# EAGLE schematic ccnor_stm32_v24-sync-unified-ss (EAGLE 6.1)
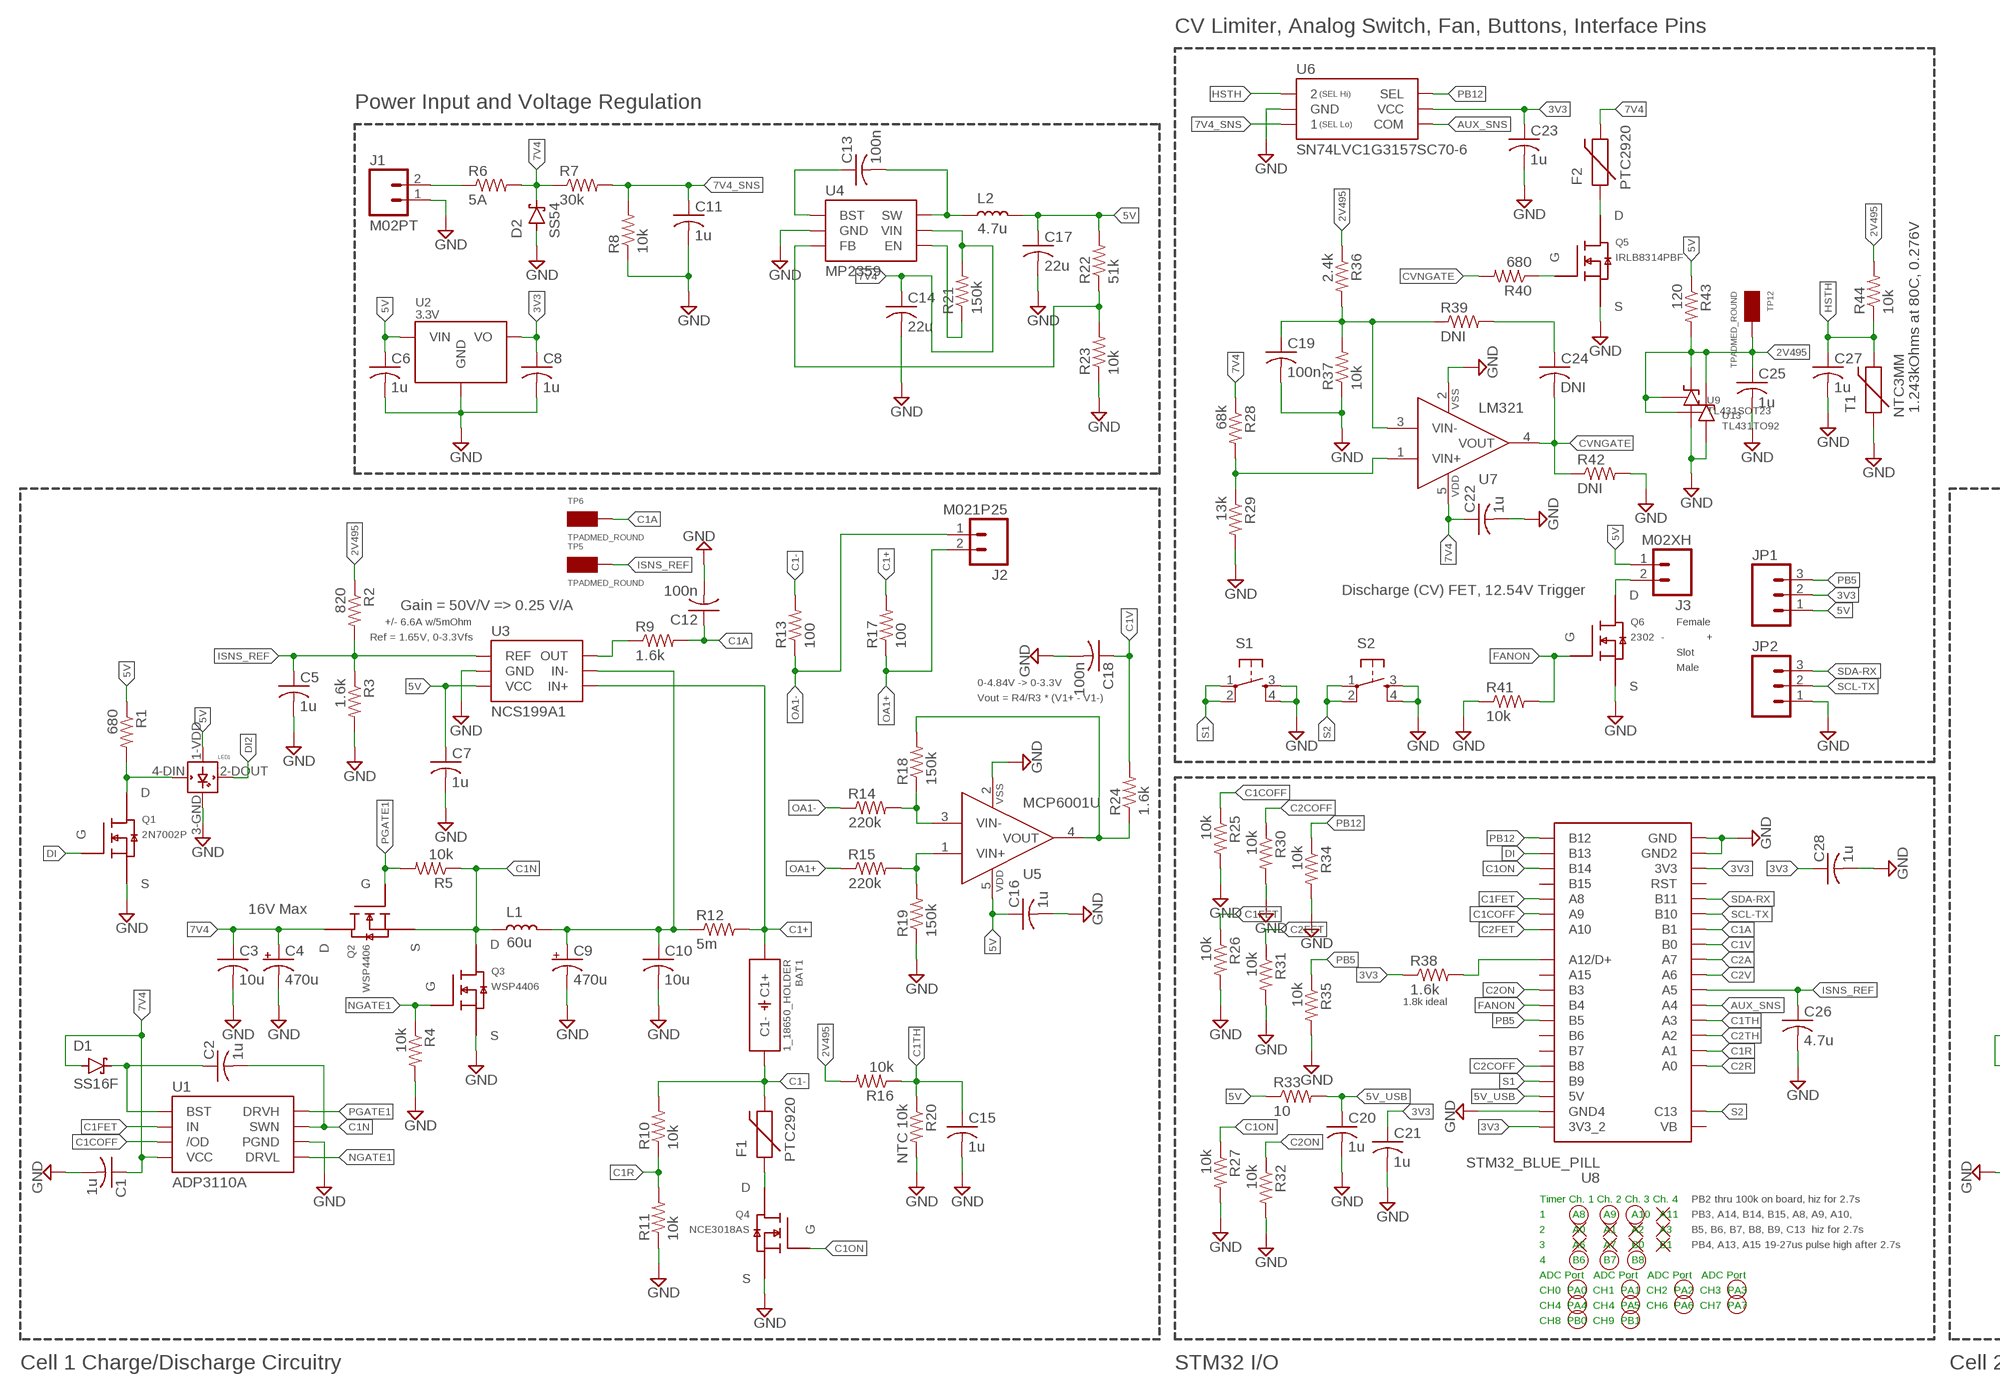
[diagram p0: schematic, sheet 1, part 1 of 2]
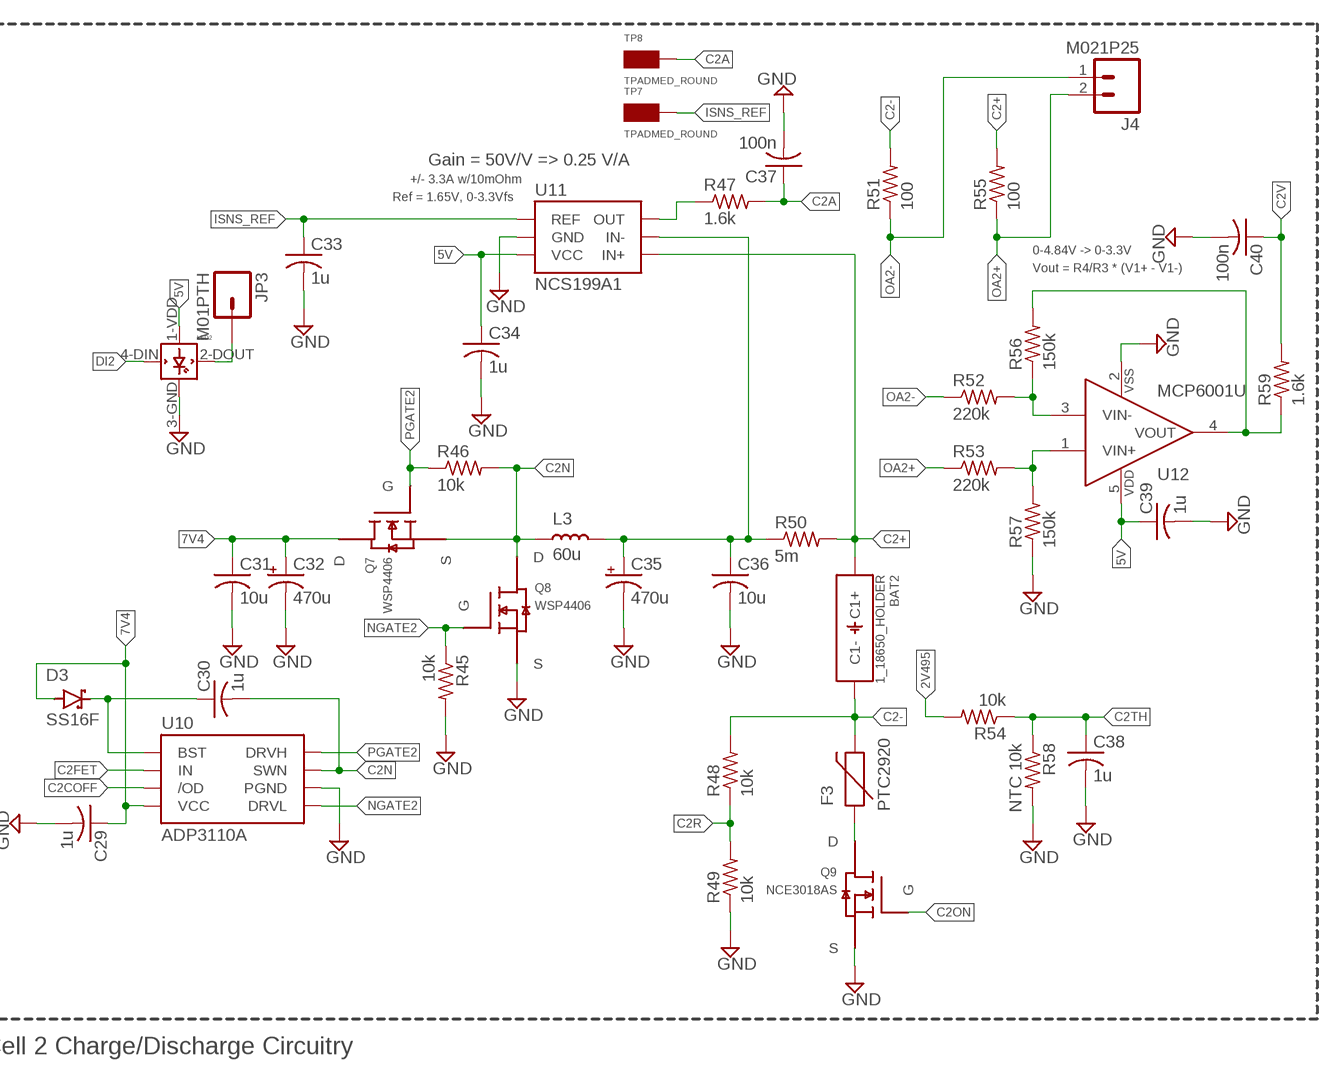
[diagram p1: schematic, sheet 1, part 2 of 2]

## Parts
BAT1  1_18650_HOLDER  [1S_18650_SMD_NH]
BAT2  1_18650_HOLDER  [1S_18650_SMD_NH]
C1  1u  C-USC0402  [C0402]
C2  1u  C-USC0603  [C0603]
C3  10u  C-USC1206  [C1206]
C4  470u  CPOL-USE2.5-7  [E2,5-7]
C5  1u  C-USC0402  [C0402]
C6  1u  C-USC0402  [C0402]
C7  1u  C-USC0402  [C0402]
C8  1u  C-USC0402  [C0402]
C9  470u  CPOL-USE2.5-7  [E2,5-7]
C10  10u  C-USC1206  [C1206]
C11  1u  C-USC0402  [C0402]
C12  100n  C-USC0402  [C0402]
C13  100n  C-USC0402  [C0402]
C14  22u  C-USC0805  [C0805]
C15  1u  C-USC0402  [C0402]
C16  1u  C-USC0402  [C0402]
C17  22u  C-USC0603  [C0603]
C18  100n  C-USC0402  [C0402]
C19  100n  C-USC0402  [C0402]
C20  1u  C-USC0402  [C0402]
C21  1u  C-USC0402  [C0402]
C22  1u  C-USC0402  [C0402]
C23  1u  C-USC0402  [C0402]
C24  DNI  C-USC0402  [C0402]
C25  1u  C-USC0402  [C0402]
C26  4.7u  C-USC0402  [C0402]
C27  1u  C-USC0402  [C0402]
C28  1u  C-USC0402  [C0402]
C29  1u  C-USC0402  [C0402]
C30  1u  C-USC0603  [C0603]
C31  10u  C-USC1206  [C1206]
C32  470u  CPOL-USE2.5-7  [E2,5-7]
C33  1u  C-USC0402  [C0402]
C34  1u  C-USC0402  [C0402]
C35  470u  CPOL-USE2.5-7  [E2,5-7]
C36  10u  C-USC1206  [C1206]
C37  100n  C-USC0402  [C0402]
C38  1u  C-USC0402  [C0402]
C39  1u  C-USC0402  [C0402]
C40  100n  C-USC0402  [C0402]
D1  SS16F  DIODE_SCHOTTKYCDBM140-G  [SOD123]
D2  SS54  [SMA]
D3  SS16F  DIODE_SCHOTTKYCDBM140-G  [SOD123]
F1  PTC2920  [2920]
F2  PTC2920  [2920]
F3  PTC2920  [2920]
J1  M02PT  [PHOENIXCONTACT1935161]
J2  M021P25  [M02_1P25MM]
J3  M02XH  [B2B-XH-A]
J4  M021P25  [M02_1P25MM]
JP1  M03PTH  [1X03]
JP2  M03PTH  [1X03]
JP3  M01PTH  [1X01]
L1  60u  INDUCTOR10A  [INDUCTOR_10A_8.2MMX21MM]
L2  4.7u  INDUCTOR0805  [0805]
L3  60u  INDUCTOR10A  [INDUCTOR_10A_8.2MMX21MM]
LED1  WS2812B  [WS2812B]
LED2  WS2812B  [WS2812B]
Q1  2N7002P  [SOT23]
Q2  WSP4406  N-MOSFET-SOIC8  [8-SOIC]
Q3  WSP4406  N-MOSFET-SOIC8  [8-SOIC]
Q4  NCE3018AS  N-MOSFET-SOIC8  [8-SOIC]
Q5  IRLB8314PBF  [TO-220]
Q6  2302  2N7002P  [SOT23]
Q7  WSP4406  N-MOSFET-SOIC8  [8-SOIC]
Q8  WSP4406  N-MOSFET-SOIC8  [8-SOIC]
Q9  NCE3018AS  N-MOSFET-SOIC8  [8-SOIC]
R1  680  R-US_R0402  [R0402]
R2  820  R-US_R0402  [R0402]
R3  1.6k  R-US_R0402  [R0402]
R4  10k  R-US_R0402  [R0402]
R5  10k  R-US_R0402  [R0402]
R6  5A  R-US_R1206  [R1206]
R7  30k  R-US_R0402  [R0402]
R8  10k  R-US_R0402  [R0402]
R9  1.6k  R-US_R0402  [R0402]
R10  10k  R-US_R0402  [R0402]
R11  10k  R-US_R0402  [R0402]
R12  5m  R-US_R1206  [R1206]
R13  100  R-US_R0402  [R0402]
R14  220k  R-US_R0402  [R0402]
R15  220k  R-US_R0402  [R0402]
R16  10k  R-US_R0402  [R0402]
R17  100  R-US_R0402  [R0402]
R18  150k  R-US_R0402  [R0402]
R19  150k  R-US_R0402  [R0402]
R20  NTC 10k  R-US_R0402  [R0402]
R21  150k  R-US_R0402  [R0402]
R22  51k  R-US_R0402  [R0402]
R23  10k  R-US_R0402  [R0402]
R24  1.6k  R-US_R0402  [R0402]
R25  10k  R-US_R0402  [R0402]
R26  10k  R-US_R0402  [R0402]
R27  10k  R-US_R0402  [R0402]
R28  68k  R-US_R0402  [R0402]
R29  13k  R-US_R0402  [R0402]
R30  10k  R-US_R0402  [R0402]
R31  10k  R-US_R0402  [R0402]
R32  10k  R-US_R0402  [R0402]
R33  10  R-US_R0402  [R0402]
R34  10k  R-US_R0402  [R0402]
R35  10k  R-US_R0402  [R0402]
R36  2.4k  R-US_R0402  [R0402]
R37  10k  R-US_R0402  [R0402]
R38  1.6k  R-US_R0402  [R0402]
R39  DNI  R-US_R0402  [R0402]
R40  680  R-US_R0402  [R0402]
R41  10k  R-US_R0402  [R0402]
R42  DNI  R-US_R0402  [R0402]
R43  120  R-US_R0402  [R0402]
R44  10k  R-US_R0402  [R0402]
R45  10k  R-US_R0402  [R0402]
R46  10k  R-US_R0402  [R0402]
R47  1.6k  R-US_R0402  [R0402]
R48  10k  R-US_R0402  [R0402]
R49  10k  R-US_R0402  [R0402]
R50  5m  R-US_R1206  [R1206]
R51  100  R-US_R0402  [R0402]
R52  220k  R-US_R0402  [R0402]
R53  220k  R-US_R0402  [R0402]
R54  10k  R-US_R0402  [R0402]
R55  100  R-US_R0402  [R0402]
R56  150k  R-US_R0402  [R0402]
R57  150k  R-US_R0402  [R0402]
R58  NTC 10k  R-US_R0402  [R0402]
R59  1.6k  R-US_R0402  [R0402]
S1  TAC_SWITCHSMD  [TACTILE_SWITCH_SMD]
S2  TAC_SWITCHSMD  [TACTILE_SWITCH_SMD]
T1  NTC3MM  PTCNTC3MM  [THERMISTOR_3MMX3MM]
TP5  TPADMED_ROUND  [TPAD_MED_ROUND]
TP6  TPADMED_ROUND  [TPAD_MED_ROUND]
TP7  TPADMED_ROUND  [TPAD_MED_ROUND]
TP8  TPADMED_ROUND  [TPAD_MED_ROUND]
TP12  TPADMED_ROUND  [TPAD_MED_ROUND]
U1  ADP3110A  [8-SOIC]
U2  3.3V  AP1117UR133-B  [SOT-89]
U3  NCS199A1  INA214  [SOT-363]
U4  MP2359  JW5052C  [SOT23-6]
U5  MCP6001U  [SOT23-5]
U6  SN74LVC1G3157SC70-6  [SC70-6]
U7  LM321  [SOT23-5]
U8  STM32_BLUE_PILL  [STM32_BLUE_PILL_USABLE]
U9  TL431SOT23  [SOT23]
U10  ADP3110A  [8-SOIC]
U11  NCS199A1  INA214  [SOT-363]
U12  MCP6001U  [SOT23-5]
U13  TL431TO92  [TO-92]

## Nets
2V495: C25.1 R2.1 R16.2 R36.1 R43.2 R44.2 R54.2 TP12.1 U9.1(K) U9.2(REF) U13.1(REF) U13.3(K)
3V3: C8.1 C21.1 C23.1 C28.1 JP1.2 R38.1 U2.1(VO) U6.5(VCC) U8.3V3 U8.3V3_2
5V: C6.1 C7.1 C16.1 C17.1 C34.1 C39.1 J3.1 JP1.1 L2.2 LED1.1-VDD(VDD) LED2.1-VDD(VDD) R1.1 R22.2 R33.1 R43.1 U2.3(VIN) U3.3(VCC) U5.5(VDD) U11.3(VCC) U12.5(VDD)
5V_USB: C20.1 R33.2 U8.5V
7V4: C1.1 C3.1 C4.+ C14.1 C22.1 C29.1 C31.1 C32.+ D1.A(ANODE) D2.K(CATHODE) D3.A(ANODE) F2.K Q2.5(D) Q2.6(D) Q2.7(D) Q2.8(D) Q7.5(D) Q7.6(D) Q7.7(D) Q7.8(D) R6.2 R7.1 R21.2 R28.1 U1.4(VCC) U4.5(VIN) U7.5(VDD) U10.4(VCC)
7V4_SNS: C11.1 R7.2 R8.2 U6.3
AUX_SNS: U6.4(COM) U8.A4
BST: C2.1 D1.K(CATHODE) U1.1(BST)
BST2: C30.1 D3.K(CATHODE) U10.1(BST)
BST5V: C13.1 U4.1(BST)
C1+: BAT1.1+(C1+) R12.2 R17.2 U3.4(IN+)
C1-: BAT1.1-(C1-) F1.K R10.2 R13.2
C1A: C12.1 R9.2 TP6.1 U8.B1
C1COFF: R25.1 U1.3(/OD) U8.A9
C1FET: R26.1 U1.2(IN) U8.A8
C1N: C2.2 L1.P$1 Q2.1(S) Q2.2(S) Q2.3(S) Q3.5(D) Q3.6(D) Q3.7(D) Q3.8(D) R5.1 U1.7(SWN)
C1ON: Q4.4(G) R27.1 U8.B14
C1R: R10.1 R11.2 U8.A1
C1TH: C15.1 R16.1 R20.1 U8.A3
C1V: C18.1 R24.2 U8.B0
C1V_OA: R18.2 R24.1 U5.4(VOUT)
C1VFBN: C24.1 R39.2
C2+: BAT2.1+(C1+) R50.2 R55.2 U11.4(IN+)
C2-: BAT2.1-(C1-) F3.K R48.2 R51.2
C2A: C37.1 R47.2 TP8.1 U8.A7
C2COFF: R30.1 U8.B8 U10.3(/OD)
C2FET: R31.1 U8.A10 U10.2(IN)
C2N: C30.2 L3.P$1 Q7.1(S) Q7.2(S) Q7.3(S) Q8.5(D) Q8.6(D) Q8.7(D) Q8.8(D) R46.2 U10.7(SWN)
C2ON: Q9.4(G) R32.1 U8.B3
C2R: R48.1 R49.2 U8.A0
C2TH: C38.1 R54.1 R58.1 U8.A2
C2V: C40.1 R59.2 U8.A6
C2V_OA: R56.2 R59.1 U12.4(VOUT)
CVNGATE: C24.2 R40.2 R42.1 U7.4(VOUT)
CVOAREF: C19.1 R36.2 R37.2 R39.1 U7.3(VIN-)
CVOASNS: R28.2 R29.1 U7.1(VIN+)
DI: Q1.1(G) U8.B13
DI1: LED1.4-DIN(DIN) Q1.3(D) R1.2
DI2: LED1.2-DOUT(DOUT) LED2.4-DIN(DIN)
EN5V: R21.1 U4.4(EN)
FANON: Q6.1(G) R41.2 U8.B4
FB5V: R22.1 R23.2 U4.3(FB)
GND: C1.2 C3.2 C4.- C5.2 C6.2 C7.2 C8.2 C9.- C10.2 C11.2 C12.2 C14.2 C15.2 C16.2 C17.2 C18.2 C19.2 C20.2 C21.2 C22.2 C23.2 C25.2 C26.2 C27.2 C28.2 C29.2 C31.2 C32.- C33.2 C34.2 C35.- C36.2 C37.2 C38.2 C39.2 C40.2 D2.A(ANODE) J1.1 JP2.1 LED1.3-GND(GND) LED2.3-GND(GND) Q1.2(S) Q3.1(S) Q3.2(S) Q3.3(S) Q4.1(S) Q4.2(S) Q4.3(S) Q5.3(S) Q6.2(S) Q8.1(S) Q8.2(S) Q8.3(S) Q9.1(S) Q9.2(S) Q9.3(S) R3.2 R4.2 R8.1 R11.1 R19.1 R20.2 R23.1 R25.2 R26.2 R27.2 R29.2 R30.2 R31.2 R32.2 R34.2 R35.2 R37.1 R41.1 R42.2 R45.2 R49.1 R57.1 R58.2 S1.3 S1.4 S2.3 S2.4 T1.1 U1.6(PGND) U2.2(GND) U2.2@1(GND) U3.2(GND) U4.2(GND) U5.2(VSS) U6.2(GND) U7.2(VSS) U8.GND U8.GND2 U8.GND4 U9.3(A) U10.6(PGND) U11.2(GND) U12.2(VSS) U13.2(A)
HSTH: C27.1 R44.1 T1.2 U6.1
IN-1: C9.+ C10.1 L1.P$2 R12.1 U3.5(IN-)
IN-2: C35.+ C36.1 L3.P$2 R50.1 U11.5(IN-)
IS1O: R9.1 U3.6(OUT)
IS1O1: R47.1 U11.6(OUT)
ISNS_REF: C5.1 C26.1 C33.1 R2.2 R3.1 TP5.1 TP7.1 U3.1(REF) U8.A5 U11.1(REF)
N$2: F3.A Q9.5(D) Q9.6(D) Q9.7(D) Q9.8(D)
N$3: R15.2 R19.2 U5.1(VIN+)
N$4: R14.2 R18.1 U5.3(VIN-)
N$6: JP3.1 LED2.2-DOUT(DOUT)
N$10: F2.A Q5.2(D)
N$13: J1.2 R6.1
N$16: R53.2 R57.2 U12.1(VIN+)
N$17: R52.2 R56.1 U12.3(VIN-)
N$26: R38.2 U8.A12(A12/D+)
N$32: F1.A Q4.5(D) Q4.6(D) Q4.7(D) Q4.8(D)
N$34: J3.2 Q6.3(D)
NGATE1: Q3.4(G) R4.1 U1.5(DRVL)
NGATE2: Q8.4(G) R45.1 U10.5(DRVL)
OA1+: J2.2 R15.1 R17.1
OA1-: J2.1 R13.1 R14.1
OA2+: J4.2 R53.1 R55.1
OA2-: J4.1 R51.1 R52.1
PB5: JP1.3 R35.1 U8.B5
PB12: R34.1 U6.6(SEL) U8.B12
PGATE1: Q2.4(G) R5.2 U1.8(DRVH)
PGATE2: Q7.4(G) R46.1 U10.8(DRVH)
Q7G: Q5.1(G) R40.1
S1: S1.1 S1.2 U8.B9
S2: S2.1 S2.2 U8.C13
SCL-TX: JP2.2 U8.B10
SDA-RX: JP2.3 U8.B11
SW5V: C13.2 L2.1 U4.6(SW)
Unconnected: U8.A15 U8.B6 U8.B7 U8.B15 U8.RST U8.VBAT(VB)

## Notes on the sheet
- CV Limiter, Analog Switch, Fan, Buttons, Interface Pins
- Power Input and Voltage Regulation
- 1.243kOhms at 80C, 0.276V
- Discharge (CV) FET, 12.54V Trigger
- Gain = 50V/V => 0.25 V/A | Gain = 50V/V => 0.25 V/A
- +/- 6.6A w/5mOhm | Female | +/- 3.3A w/10mOhm
- Ref = 1.65V, 0-3.3Vfs | - | + | Ref = 1.65V, 0-3.3Vfs
- Slot
- Male
- 0-4.84V -> 0-3.3V | 0-4.84V -> 0-3.3V
- Vout = R4/R3 * (V1+ - V1-) | Vout = R4/R3 * (V1+ - V1-)
- 16V Max
- 1.8k ideal
- Timer Ch. 1 Ch. 2 Ch. 3 Ch. 4 | PB2 thru 100k on board, hiz for 2.7s
- 1         A8      A9     A10   A11 | PB3, A14, B14, B15, A8, A9, A10,
- 2         A0      A1     A2     A3 | B5, B6, B7, B8, B9, C13  hiz for 2.7s
- 3         A6      A7     B0     B1 | PB4, A13, A15 19-27us pulse high after 2.7s
- 4         B6      B7     B8
- ADC Port   ADC Port   ADC Port   ADC Port
- CH0  PA0  CH1  PA1  CH2  PA2  CH3  PA3
- CH4  PA4  CH4  PA5  CH6  PA6  CH7  PA7
- CH8  PB0  CH9  PB1
- Cell 1 Charge/Discharge Circuitry | STM32 I/O | Cell 2 Charge/Discharge Circuitry

## Library data of the parts
BAT1 BAT2 = custom:1_18650_HOLDER
C1-C3 C5-C8 C10-C31 C33 C34 C36-C40 = resistor:C-US: CAPACITOR, American symbol
C4 C9 C32 C35 = resistor:CPOL-US: POLARIZED CAPACITOR, American symbol
D1 D3 = custom:DIODE_SCHOTTKY: 40V 1A 500mV @1A
D2 = custom:SS54: Diode Schottky 40V 5A 1mA Ir 0.55Vf
F1-F3 T1 = custom:PTC
J1-J4 = custom:M02: 2-pin Header
JP1 JP2 = SparkFun:M03: Header 3 Standard 3-pin 0.1" header. Use with straight break away headers (SKU : PRT-00116), right angle break away headers (PRT-00553), swiss pins (PRT-00743), machine pins (PRT-00117), and female headers (PRT-00115). Molex polarized connector foot print use with SKU : PRT-08232 with associated crimp pins and housings.
JP3 = SparkFun:M01: Header 1 Standard 1-pin 0.1" header. Use with straight break away headers (SKU : PRT-00116), right angle break away headers (PRT-00553), swiss pins (PRT-00743), machine pins (PRT-00117), and female headers (PRT-00115).
L1-L3 = custom:INDUCTOR
LED1 LED2 = adafruit:WS2812B
Q1 Q6 = custom:2N7002P: 2N7002P N-channel MOSFET 60V 360mA Logic Level
Q2-Q4 Q7-Q9 = custom:N-MOSFET-SOIC8
Q5 = custom:IRLB8314PBF: MOSFET N-Channel 30V 184A 3.2mOhm @4.5Vgs 125W
R1-R59 = resistor:R-US_: RESISTOR, American symbol
S1 S2 = SparkFun:TAC_SWITCH: Momentary Switch Button commonly used for reset or general input. Spark Fun Electronics SKU : COM-00097
TP5-TP8 TP12 = custom:TPAD
U1 U10 = custom:ADP3110A: MOSFET Driver Dual Bootstrapped 12 V w/Output Disable 3nF 25ns Synchronous
U2 = custom:AP1117: Linear Voltage Regulator 18V Max 1A
U3 U11 = custom:INA214: Current Shunt Amplifier 30kHz 2.7-26V
U4 = custom:JW5052C: Buck Regulator Synchronous 4.5-18V 2A 700kHz 100uA 120mOhm
U5 U12 = custom:MCP6001: Op-Amp Single Rail-to-Rail 1MHz
U6 = custom:SN74LVC1G3157: Single Analog Mux IC Switch 2:1 15 Ohm 1.65-5.5V
U7 = custom:LM321: Op-Amp Low Power Single 3-32V Vcm 0-(Vcc-1.5) Vo 0.02-(Vcc-2)
U8 = custom:STM32_BLUE_PILL
U9 U13 = custom:TL431: Shunt Voltage Reference IC 700uA 100mA 36V